# EAGLE design EE445L_Lab_7_Starter (EAGLE 9.6.2)
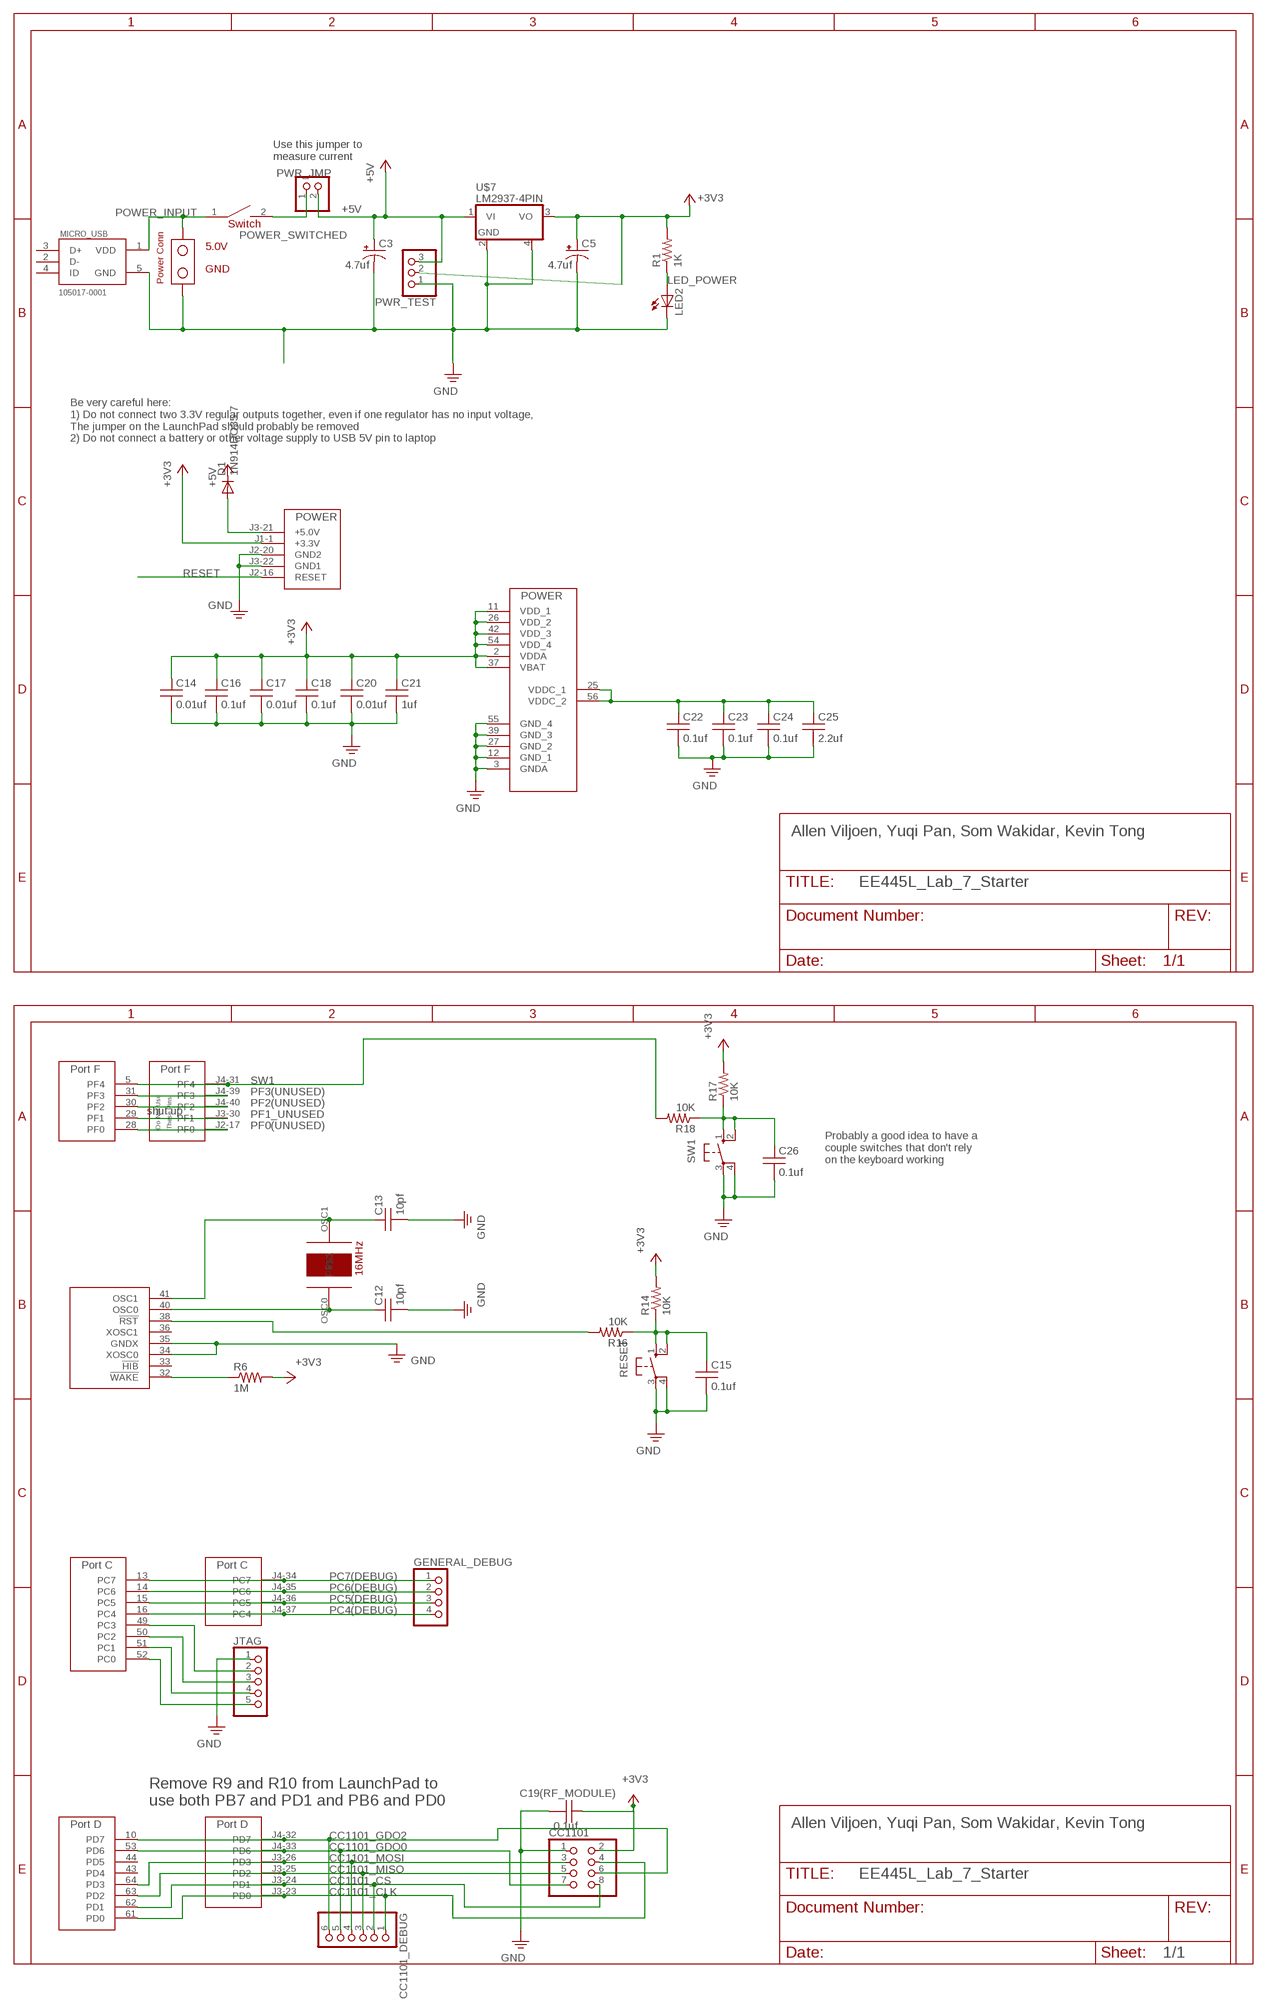
[diagram p0: schematic, sheet 1, part 1 of 2]
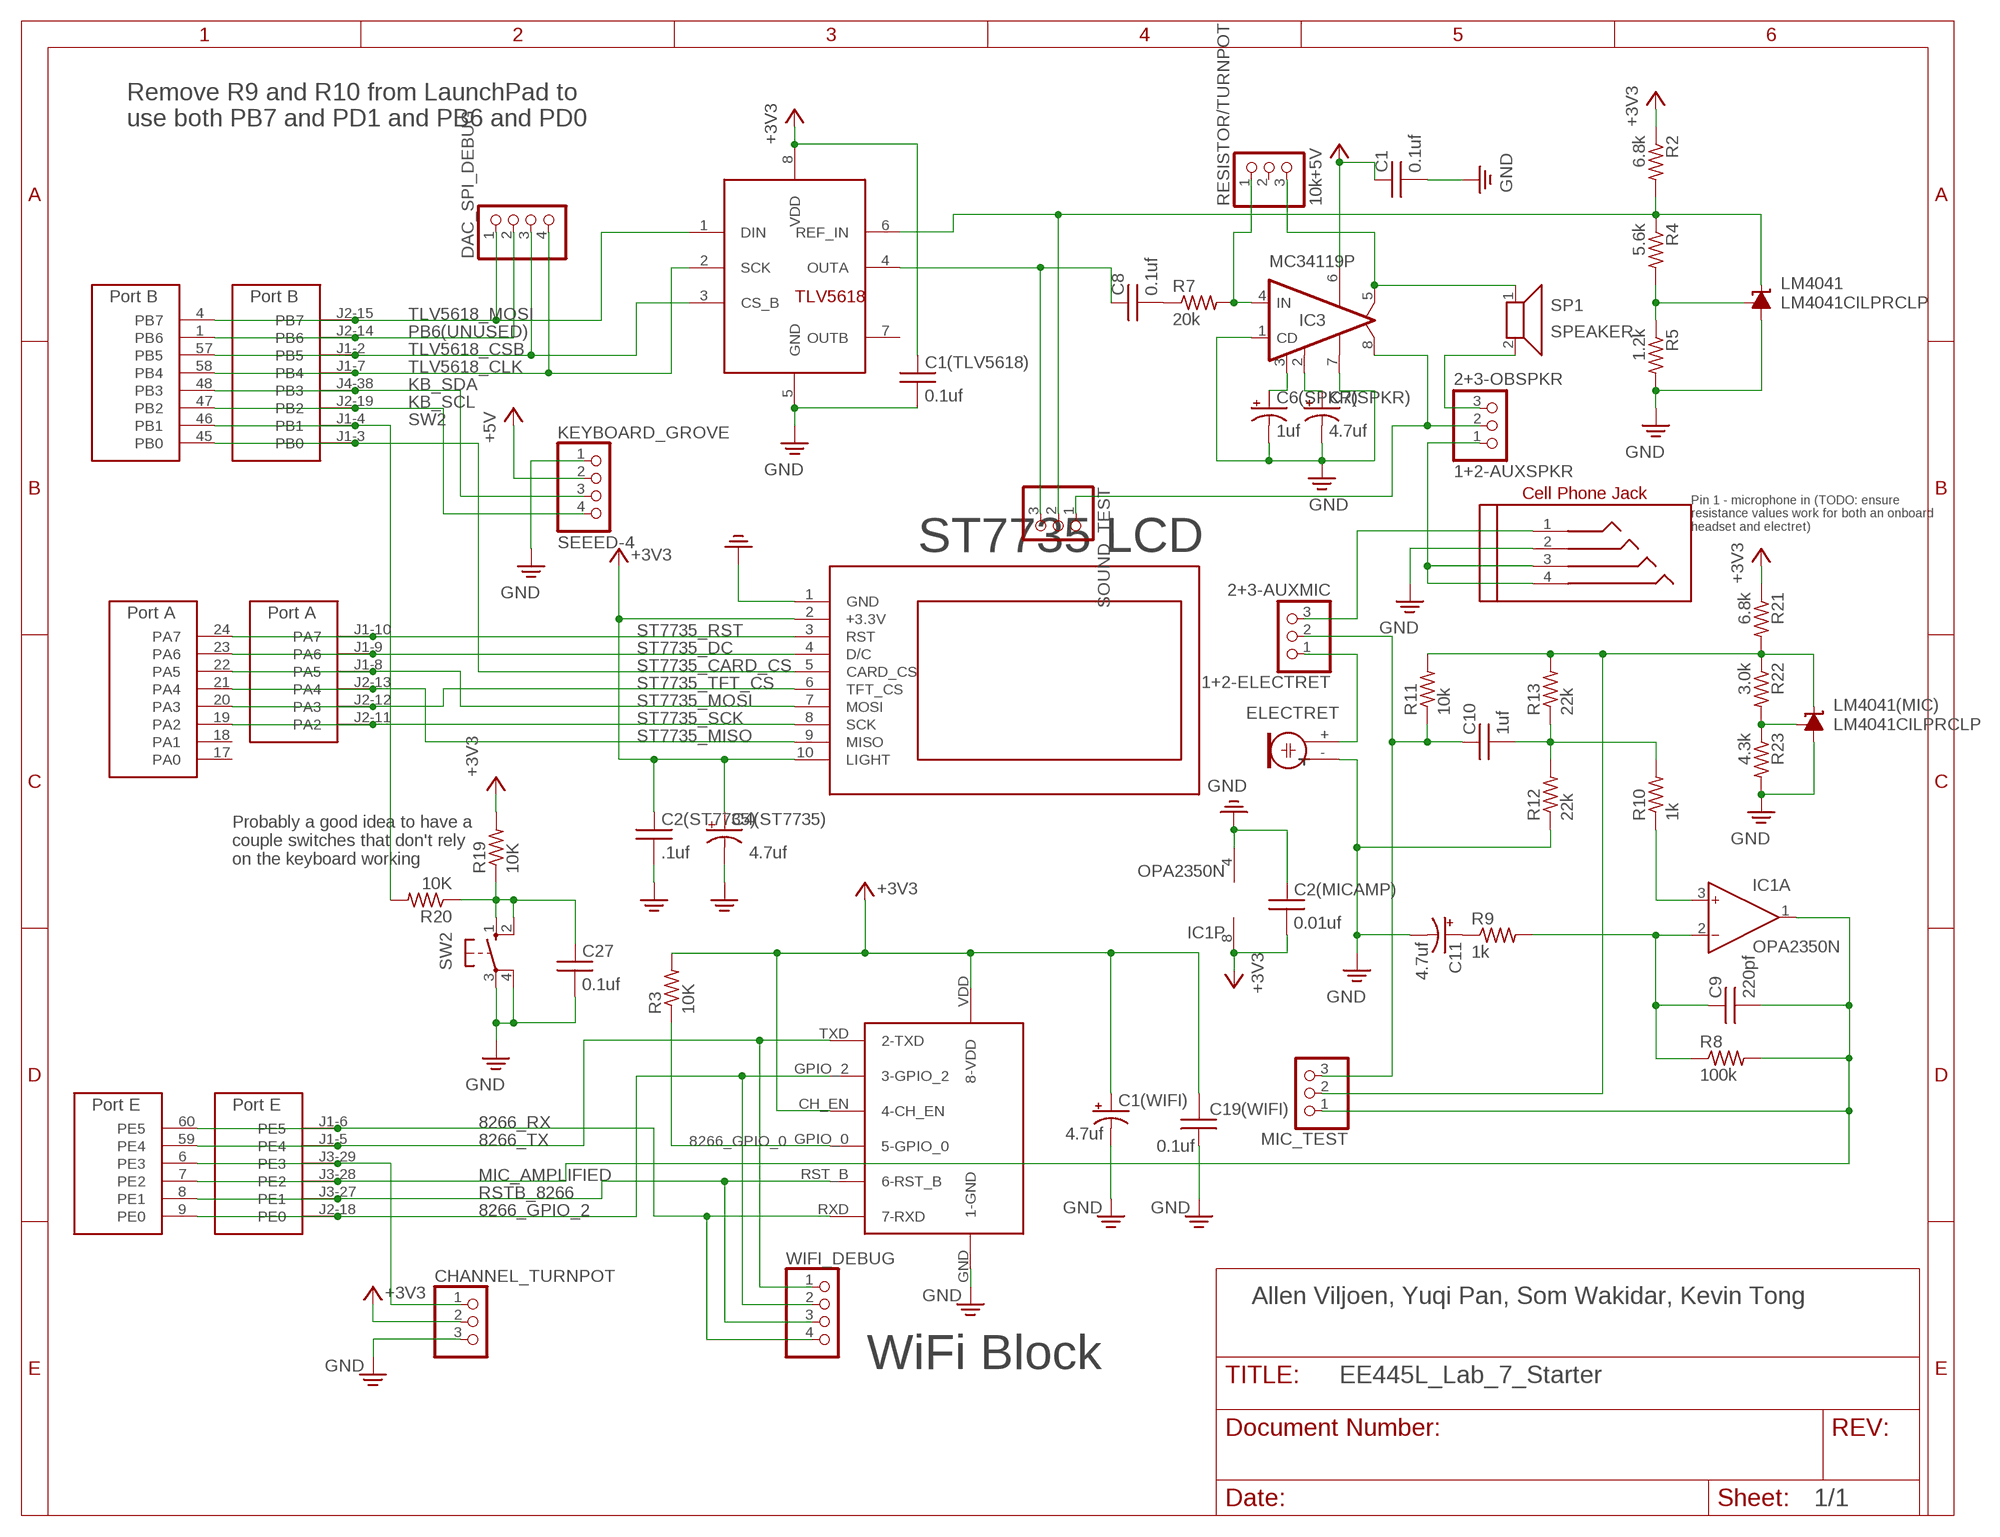
[diagram p1: schematic, sheet 1, part 2 of 2]

## Parts
1+2-AUXSPKR  2+3-OBSPKR  PINHD-1X3  [1X03]
1+2-ELECTRET  2+3-AUXMIC  PINHD-1X3  [1X03]
C1  0.1uf  CAPACITOR025-024X044  [CAP100MIL]
C1(TLV5618)  0.1uf  CAPACITOR050-024X044  [CAP200MIL]
C1(WIFI)  4.7uf  CAPACITOR_POLARIZEDE5-6  [CAP200MILPOLARIZED]
C2(MICAMP)  0.01uf  CAPACITOR050-024X044  [CAP200MIL]
C2(ST7735)  .1uf  CAPACITOR050-024X044  [CAP200MIL]
C3  4.7uf  CAPACITOR_POLARIZEDE5-6  [CAP200MILPOLARIZED]
C4(ST7735)  4.7uf  CAPACITOR_POLARIZEDE5-6  [CAP200MILPOLARIZED]
C5  4.7uf  CAPACITOR_POLARIZEDE5-6  [CAP200MILPOLARIZED]
C6(SPKR)  1uf  CAPACITOR_POLARIZEDE5-6  [CAP200MILPOLARIZED]
C7(SPKR)  4.7uf  CAPACITOR_POLARIZEDE5-6  [CAP200MILPOLARIZED]
C8  0.1uf  CAPACITOR025-024X044  [CAP100MIL]
C9  220pf  CAPACITOR050-024X044  [CAP200MIL]
C10  1uf  CAPACITOR050-024X044  [CAP200MIL]
C11  4.7uf  CAPACITOR_POLARIZEDE5-6  [CAP200MILPOLARIZED]
C12  10pf  CAPACITOR025-024X044  [CAP100MIL]
C13  10pf  CAPACITOR025-024X044  [CAP100MIL]
C14  0.01uf  CAPACITOR025-024X044  [CAP100MIL]
C15  0.1uf  CAPACITOR025-024X044  [CAP100MIL]
C16  0.1uf  CAPACITOR025-024X044  [CAP100MIL]
C17  0.01uf  CAPACITOR025-024X044  [CAP100MIL]
C18  0.1uf  CAPACITOR025-024X044  [CAP100MIL]
C19(RF_MODULE)  0.1uf  CAPACITOR025-024X044  [CAP100MIL]
C19(WIFI)  0.1uf  CAPACITOR050-024X044  [CAP200MIL]
C20  0.01uf  CAPACITOR025-024X044  [CAP100MIL]
C21  1uf  CAPACITOR025-024X044  [CAP100MIL]
C22  0.1uf  CAPACITOR025-024X044  [CAP100MIL]
C23  0.1uf  CAPACITOR025-024X044  [CAP100MIL]
C24  0.1uf  CAPACITOR025-024X044  [CAP100MIL]
C25  2.2uf  CAPACITOR025-024X044  [CAP100MIL]
C26  0.1uf  CAPACITOR025-024X044  [CAP100MIL]
C27  0.1uf  CAPACITOR025-024X044  [CAP100MIL]
CC1101  PINHD-2X4  [2X04]
CC1101_DEBUG  PINHD-1X6  [1X06]
CHANNEL_TURNPOT  PINHD-1X3  [1X03]
D1  1N914DO35-7  [DO35-7]
DAC_SPI_DEBUG  PINHD-1X4/90  [1X04/90]
ELECTRET  ELECTRET  [9.7ELECTRET]
GENERAL_DEBUG  PINHD-1X4/90  [1X04/90]
IC1  OPA2350N  [DIL08]
IC3  MC34119P  [DIL08]
JTAG  PINHD-1X5  [1X05]
KEYBOARD_GROVE  SEEED-4  [1_04X2MM]
LED2  LED3MM  [LED3MM]
LM4041  LM4041CILPRCLP  [LP_O-PBCY-W3]
LM4041(MIC)  LM4041CILPRCLP  [LP_O-PBCY-W3]
MIC_TEST  PINHD-1X3/90  [1X03/90]
MICRO_USB  105017-0001  [MOLEX_105017-0001]
PWR_JMP  PINHD-1X2  [1X02]
PWR_TEST  PINHD-1X3/90  [1X03/90]
R1  1K  RESISTOR0204/5  [RES200MIL]
R2  6.8k  RESISTOR0204/7  [RES300MIL]
R3  10K  RESISTOR0204/7  [RES300MIL]
R4  5.6k  RESISTOR0204/7  [RES300MIL]
R5  1.2k  RESISTOR0204/7  [RES300MIL]
R6  1M  RESISTOR0204/7  [RES300MIL]
R7  20k  RESISTOR0204/7  [RES300MIL]
R8  100k  RESISTOR0204/7  [RES300MIL]
R9  1k  RESISTOR0204/7  [RES300MIL]
R10  1k  RESISTOR0204/7  [RES300MIL]
R11  10k  RESISTOR0204/7  [RES300MIL]
R12  22k  RESISTOR0204/7  [RES300MIL]
R13  22k  RESISTOR0204/7  [RES300MIL]
R14  10K  RESISTOR0204/5  [RES200MIL]
R16  10K  RESISTOR0204/5  [RES200MIL]
R17  10K  RESISTOR0204/5  [RES200MIL]
R18  10K  RESISTOR0204/5  [RES200MIL]
R19  10K  RESISTOR0204/5  [RES200MIL]
R20  10K  RESISTOR0204/5  [RES200MIL]
R21  6.8k  RESISTOR0204/7  [RES300MIL]
R22  3.0k  RESISTOR0204/7  [RES300MIL]
R23  4.3k  RESISTOR0204/7  [RES300MIL]
RESET  B3F-1052  [B3F-10XX]
RESISTOR/TURNPOT  10k  PINHD-1X3/90  [1X03/90]
SOUND_TEST  PINHD-1X3/90  [1X03/90]
SP1  SPEAKER  [1X02]
ST7735  ST7735  [ST7735]
SW1  B3F-1052  [B3F-10XX]
SW2  B3F-1052  [B3F-10XX]
TLV5618  TLV5618  [DIL08]
U$1  ESP_8266  [ESP8266]
U$2  TM4C_BP  [TM4C_BOOSTER_PACK]
U$5  POWER_CONN  [POWER_CONN]
U$6  SW_POWER_100MIL  [SW_POWER]
U$7  LM2937-4PIN  [TO220-4PIN]
U$8  AUDIO_CONN_3.5MM  [AUDIO_CONN_3.5MM]
U$9  TM4C123GH6PM  [QFP50P1200X1200X160-64N]
WIFI_DEBUG  PINHD-1X4/90  [1X04/90]
Y1  16MHZ_CRYSTAL  [16MHZ_CRYSTAL]

## Nets
8266_GPIO_0: R3.1 U$1.GPIO_0(5-GPIO_0)
8266_GPIO_2: U$1.GPIO_2(3-GPIO_2) U$2.J2-18(PE0) U$9.9(PE0) WIFI_DEBUG.2
8266_RX: U$1.RXD(7-RXD) U$2.J1-6(PE5) U$9.60(PE5) WIFI_DEBUG.4
8266_TX: U$1.TXD(2-TXD) U$2.J1-5(PE4) U$9.59(PE4) WIFI_DEBUG.1
+3V3: C1(TLV5618).1 C1(WIFI).+ C2(MICAMP).2 C2(ST7735).1 C4(ST7735).+ C5.+ C14.1 C16.1 C17.1 C18.1 C19(RF_MODULE).1 C19(WIFI).2 C20.1 C21.1 CC1101.2 CHANNEL_TURNPOT.2 IC1.8(P:V+) PWR_TEST.2 R1.2 R2.1 R3.2 R6.2 R14.2 R17.2 R19.2 R21.1 ST7735.2(+3.3V) ST7735.10(LIGHT) TLV5618.8(VDD) U$1.CH_EN(4-CH_EN) U$1.VDD(8-VDD) U$2.J1-1(+3.3V) U$7.3(VO) U$9.2(VDDA) U$9.11(VDD_1) U$9.26(VDD_2) U$9.37(VBAT) U$9.42(VDD_3) U$9.54(VDD_4)
+5V: C1.1 C3.+ D1.C IC3.6(VCC) KEYBOARD_GROVE.2 PWR_JMP.2 PWR_TEST.3 U$7.1(VI)
AUDIO_AMP_OUT: 1+2-AUXSPKR.2 IC3.8(VO2) SOUND_TEST.1
AUX_AUDIO: 1+2-AUXSPKR.1 U$8.3 U$8.4
AUX_MIC: 1+2-ELECTRET.3 U$8.1
CC1101_CLK: CC1101.4 CC1101_DEBUG.1 U$2.J3-23(PD0) U$9.61(PD0)
CC1101_CS: CC1101.8 CC1101_DEBUG.2 U$2.J3-24(PD1) U$9.62(PD1)
CC1101_GDO0: CC1101.7 CC1101_DEBUG.5 U$2.J4-33(PD6) U$9.53(PD6)
CC1101_GDO2: CC1101.6 CC1101_DEBUG.6 U$2.J4-32(PD7) U$9.10(PD7)
CC1101_MISO: CC1101.5 CC1101_DEBUG.3 U$2.J3-25(PD2) U$9.63(PD2)
CC1101_MOSI: CC1101.3 CC1101_DEBUG.4 U$2.J3-26(PD3) U$9.64(PD3)
CHANNEL_TURNPOT: CHANNEL_TURNPOT.1 U$2.J3-29(PE3) U$9.6(PE3)
DAC_OUT: C8.1 SOUND_TEST.3 TLV5618.4(OUTA)
ELECTRET_MIC: 1+2-ELECTRET.1 ELECTRET.+
GND: C1(TLV5618).2 C1(WIFI).- C1.2 C2(MICAMP).1 C2(ST7735).2 C3.- C4(ST7735).- C5.- C6(SPKR).- C7(SPKR).- C11.- C12.2 C13.2 C14.2 C15.2 C16.2 C17.2 C18.2 C19(RF_MODULE).2 C19(WIFI).1 C20.2 C21.2 C22.2 C23.2 C24.2 C25.2 C26.2 C27.2 CC1101.1 CHANNEL_TURNPOT.3 ELECTRET.- IC1.4(P:V-) IC3.1(CD) IC3.7(GND) JTAG.1 KEYBOARD_GROVE.1 LED2.K(C) LM4041(MIC).3(A) LM4041.3(A) MICRO_USB.5(GND) PWR_TEST.1 R5.2 R12.1 R23.2 RESET.3(P) RESET.4(P1) ST7735.1(GND) SW1.3(P) SW1.4(P1) SW2.3(P) SW2.4(P1) TLV5618.5(GND) U$1.GND(1-GND) U$2.J2-20(GND2) U$2.J3-22(GND1) U$5.GND U$7.2(GND) U$7.4(PAD) U$8.2 U$9.3(GNDA) U$9.12(GND_1) U$9.27(GND_2) U$9.34(XOSC0) U$9.35(GNDX) U$9.39(GND_3) U$9.55(GND_4)
ICDI-TCK/SWCLK: JTAG.5 U$9.52(PC0)
ICDI-TDI: JTAG.3 U$9.50(PC2)
ICDI-TDO/SWO: JTAG.2 U$9.49(PC3)
ICDI-TMS/SWDIO: JTAG.4 U$9.51(PC1)
KB_SCL: KEYBOARD_GROVE.4 U$2.J2-19(PB2) U$9.47(PB2)
KB_SDA: KEYBOARD_GROVE.3 U$2.J4-38(PB3) U$9.48(PB3)
LED_POWER: LED2.A R1.1
MIC_AMPLIFIED: C9.2 IC1.1(A:OUT) MIC_TEST.1 R8.2 U$2.J3-28(PE2) U$9.7(PE2)
MIC_FEEDBACK/GND: C9.1 IC1.2(A:IN-) R8.1 R9.2
MIC_FILTER: C10.2 R10.2 R12.2 R13.1
MIC_FILTERED: IC1.3(A:IN+) R10.1
MIC_OUT_RAW: 1+2-ELECTRET.2 C10.1 MIC_TEST.3 R11.1
MIC_REF: LM4041(MIC).2(C) MIC_TEST.2 R11.2 R13.2 R21.2 R22.1
MIC_REF_FB: LM4041(MIC).1(FB) R22.2 R23.1
N$1: C8.2 R7.1
N$2: C11.+ R9.1
N$3: D1.A U$2.J3-21(+5.0V)
OSC0: C12.1 U$9.40(OSC0) Y1.OSC0
OSC1: C13.1 U$9.41(OSC1) Y1.OSC1
PB6(UNUSED): DAC_SPI_DEBUG.2 U$2.J2-14(PB6) U$9.1(PB6)
PC4(DEBUG): GENERAL_DEBUG.4 U$2.J4-37(PC4) U$9.16(PC4)
PC5(DEBUG): GENERAL_DEBUG.3 U$2.J4-36(PC5) U$9.15(PC5)
PC6(DEBUG): GENERAL_DEBUG.2 U$2.J4-35(PC6) U$9.14(PC6)
PC7(DEBUG): GENERAL_DEBUG.1 U$2.J4-34(PC7) U$9.13(PC7)
PF0(UNUSED): U$2.J2-17(PF0) U$9.28(PF0)
PF1_UNUSED: U$2.J3-30(PF1) U$9.29(PF1)
PF2(UNUSED): U$2.J4-40(PF2) U$9.30(PF2)
PF3(UNUSED): U$2.J4-39(PF3) U$9.31(PF3)
POWER_INPUT: MICRO_USB.1(VDD) U$5.VDD U$6.1
POWER_SWITCHED: PWR_JMP.1 U$6.2
RESET: U$2.J2-16(RESET)
RESET_DEBOUNCE: C15.1 R14.1 R16.1 RESET.1(S) RESET.2(S1)
RESET_IN: R16.2 U$9.38(!RST)
RSTB_8266: U$1.RST_B(6-RST_B) U$2.J3-27(PE1) U$9.8(PE1) WIFI_DEBUG.3
SPKR_OUT: 1+2-AUXSPKR.3 SP1.2
SPKRAMP_GND0: C7(SPKR).+ IC3.2(FC2)
SPKRAMP_GND1: C6(SPKR).+ IC3.3(FC1)
SPKRAMP_OUT: IC3.5(VO1) RESISTOR/TURNPOT.3 SP1.1
SPKRAMP_TURNPOT: IC3.4(IN) R7.2 RESISTOR/TURNPOT.1
ST7735_CARD_CS: ST7735.5(CARD_CS) U$2.J1-3(PB0) U$9.45(PB0)
ST7735_DC: ST7735.4(D/C) U$2.J1-9(PA6) U$9.23(PA6)
ST7735_MISO: ST7735.9(MISO) U$2.J2-13(PA4) U$9.21(PA4)
ST7735_MOSI: ST7735.7(MOSI) U$2.J1-8(PA5) U$9.22(PA5)
ST7735_RST: ST7735.3(RST) U$2.J1-10(PA7) U$9.24(PA7)
ST7735_SCK: ST7735.8(SCK) U$2.J2-11(PA2) U$9.19(PA2)
ST7735_TFT_CS: ST7735.6(TFT_CS) U$2.J2-12(PA3) U$9.20(PA3)
SW1: R18.2 U$2.J4-31(PF4) U$9.5(PF4)
SW1_DEBOUNCE: C26.1 R17.1 R18.1 SW1.1(S) SW1.2(S1)
SW2: R20.2 U$2.J1-4(PB1) U$9.46(PB1)
SW2_DEBOUNCE: C27.1 R19.1 R20.1 SW2.1(S) SW2.2(S1)
TLV5616_REF_FB: LM4041.1(FB) R4.2 R5.1
TLV5618_CLK: DAC_SPI_DEBUG.4 TLV5618.2(SCK) U$2.J1-7(PB4) U$9.58(PB4)
TLV5618_CSB: DAC_SPI_DEBUG.3 TLV5618.3(CS_B) U$2.J1-2(PB5) U$9.57(PB5)
TLV5618_MOSI: DAC_SPI_DEBUG.1 TLV5618.1(DIN) U$2.J2-15(PB7) U$9.4(PB7)
TLV5618_REF: LM4041.2(C) R2.2 R4.1 SOUND_TEST.2 TLV5618.6(REF_IN)
VDDC: C22.1 C23.1 C24.1 C25.1 U$9.25(VDDC_1) U$9.56(VDDC_2)
WAKE: R6.1 U$9.32(!WAKE)
Unconnected: IC1.5(B:IN+) IC1.6(B:IN-) IC1.7(B:OUT) MICRO_USB.2(D-) MICRO_USB.3(D+) MICRO_USB.4(ID) RESISTOR/TURNPOT.2 TLV5618.7(OUTB) U$9.17(PA0) U$9.18(PA1) U$9.33(!HIB) U$9.36(XOSC1) U$9.43(PD4) U$9.44(PD5)

## Notes on the sheet
- Use this jumper to
  measure current
- Be very careful here:
  1) Do not connect two 3.3V regular outputs together, even if one regulator has no input voltage,
  The jumper on the LaunchPad should probably be removed
  2) Do not connect a battery or other voltage supply to USB 5V pin to laptop
- Allen Viljoen, Yuqi Pan, Som Wakidar, Kevin Tong
- Remove R9 and R10 from LaunchPad to
  use both PB7 and PD1 and PB6 and PD0
- shut up
- Probably a good idea to have a 
  couple switches that don't rely 
  on the keyboard working
- Pin 1 - microphone in (TODO: ensure
  resistance values work for both an onboard
  headset and electret)
- ST7735 LCD
- Probably a good idea to have a 
  couple switches that don't rely 
  on the keyboard working
- Remove R9 and R10 from LaunchPad to
  use both PB7 and PD1 and PB6 and PD0
- Allen Viljoen, Yuqi Pan, Som Wakidar, Kevin Tong
- Allen Viljoen, Yuqi Pan, Som Wakidar, Kevin Tong
- WiFi Block

## Library data of the parts
1+2-AUXSPKR 1+2-ELECTRET CHANNEL_TURNPOT MIC_TEST PWR_TEST RESISTOR/TURNPOT SOUND_TEST = EE445L:PINHD-1X3: PIN HEADER
C1 C1(TLV5618) C2(MICAMP) C2(ST7735) C8-C10 C12-C18 C19(RF_MODULE) C19(WIFI) C20-C27 = EE445L:CAPACITOR: CAPACITOR, American symbol
C1(WIFI) C3 C4(ST7735) C5 C6(SPKR) C7(SPKR) C11 = EE445L:CAPACITOR_POLARIZED: POLARIZED CAPACITOR, American symbol
CC1101 = EE445L:PINHD-2X4: PIN HEADER
CC1101_DEBUG = EE445L:PINHD-1X6: PIN HEADER
D1 = EE445L:1N914: DIODE high speed (Philips) 1N914
DAC_SPI_DEBUG GENERAL_DEBUG WIFI_DEBUG = EE445L:PINHD-1X4: PIN HEADER
ELECTRET = EE445L:ELECTRET: Electret microphone Thru hole 2.54mm spacing with 9.7mm diameter
IC1 = EE445L:OPA2350: 2.7V to 5.5V Rail-to-Rail I/O Dual Amplifier High-Speed 38MHz, Single-Supply, slew rate 22V/us, 500uV offset, 4uV noise; OC_FARNELL: unknown; OC_NEWARK: unknown
IC3 = EE445L:MC34119: Low Power Audio Amplifier Motorola
JTAG = EE445L:PINHD-1X5: PIN HEADER
KEYBOARD_GROVE = EE445L:SEEED-4: Seeedstudio grove 2mm spacing, Valvano http://www.seeedstudio.com/depot/Grove-Universal-4-pin-connector-9010-PCs-p-790.html?cPath=44_80
LED2 = EE445L:LED: Avago Technologies LED Green 2mA 5mm diffused, HLMP-4740, Digikey 516-1327-ND Red 1.6V 1mA 5mm diffused, HLMP-D150, Digikey 516-1323-ND Yellow 2mA 5mm diffused, HLMP-4719, Digikey 516-1326-ND Orange 10mA 5mm diffused HLMP-D401, Digikey 516-1330-ND Blue 10mA 5mm diffused
LM4041 LM4041(MIC) = EE445L:LM4041CILPR: PRECISION MICROPOWER SHUNT VOLTAGE REFERENCE Adjustable Output Source: http://focus.ti.com/lit/ds/slcs146e/slcs146e.pdf LM4041CILPR Let R1 be the resistor from Vref to +3.3V Let R2 be the resistor from Vref to FB Let R3 be the resistor from FB to ground Vref = 1.23*(1+R3/R2) Iref=(3.3V-Vref)/R1 - 100uA; MPN: LM4041CILP; OC_FARNELL: 1673945; OC_NEWARK: 50M8856
MICRO_USB = 105017-0001:105017-0001: Check availability <https://pricing.snapeda.com/parts/105017-0001/Molex/view-part?ref=eda>; AVAILABILITY: In Stock; DESCRIPTION: USB - micro B USB 2.0 Receptacle Connector 5 Position Surface Mount, Right Angle; Through Hole; MF: Molex; MP: 105017-0001; PACKAGE: None; PRICE: None; PURCHASE-URL: https://pricing.snapeda.com/search/part/105017-0001/?ref=eda
PWR_JMP = EE445L:PINHD-1X2: PIN HEADER
R1-R14 R16-R23 = EE445L:RESISTOR: RESISTOR, American symbol
RESET SW1 SW2 = EE445L:B3F-1052: OMRON SWITCH 1.1mm holes; MPN: B3F-1000; OC_FARNELL: 176432; OC_NEWARK: 36M3542
SP1 = EE445L:SPEAKER: Speaker Connected off PCB with two wires. 32-ohm speaker, AllElectronics, SK-230, http://www.allelectronics.com/make-a-store/item/sk-230/20-mm-32-ohm-speaker/1.html
ST7735 = EE445L:ST7735
TLV5618 = EE445L:TLV5618: The TLV5618A is a dual 12-bit voltage output DAC with a flexible 3-wire serial interface. The serial interface is compatible with TMS320, SPI, QSPI, and Microwire serial ports. It is programmed with a 16-bit serial string containing 4 control and 12 data bits
U$1 = EE445L:ESP_8266
U$2 = EE445L:TM4C_BP
U$5 = EE445L:POWER_CONN
U$6 = EE445L:SW_POWER_100MIL
U$7 = EE445L:LM2937-4PIN
U$8 = EE445L:AUDIO_CONN_3.5MM
U$9 = EE445L:TM4C123GH6PM
Y1 = EE445L:16MHZ_CRYSTAL

## Board
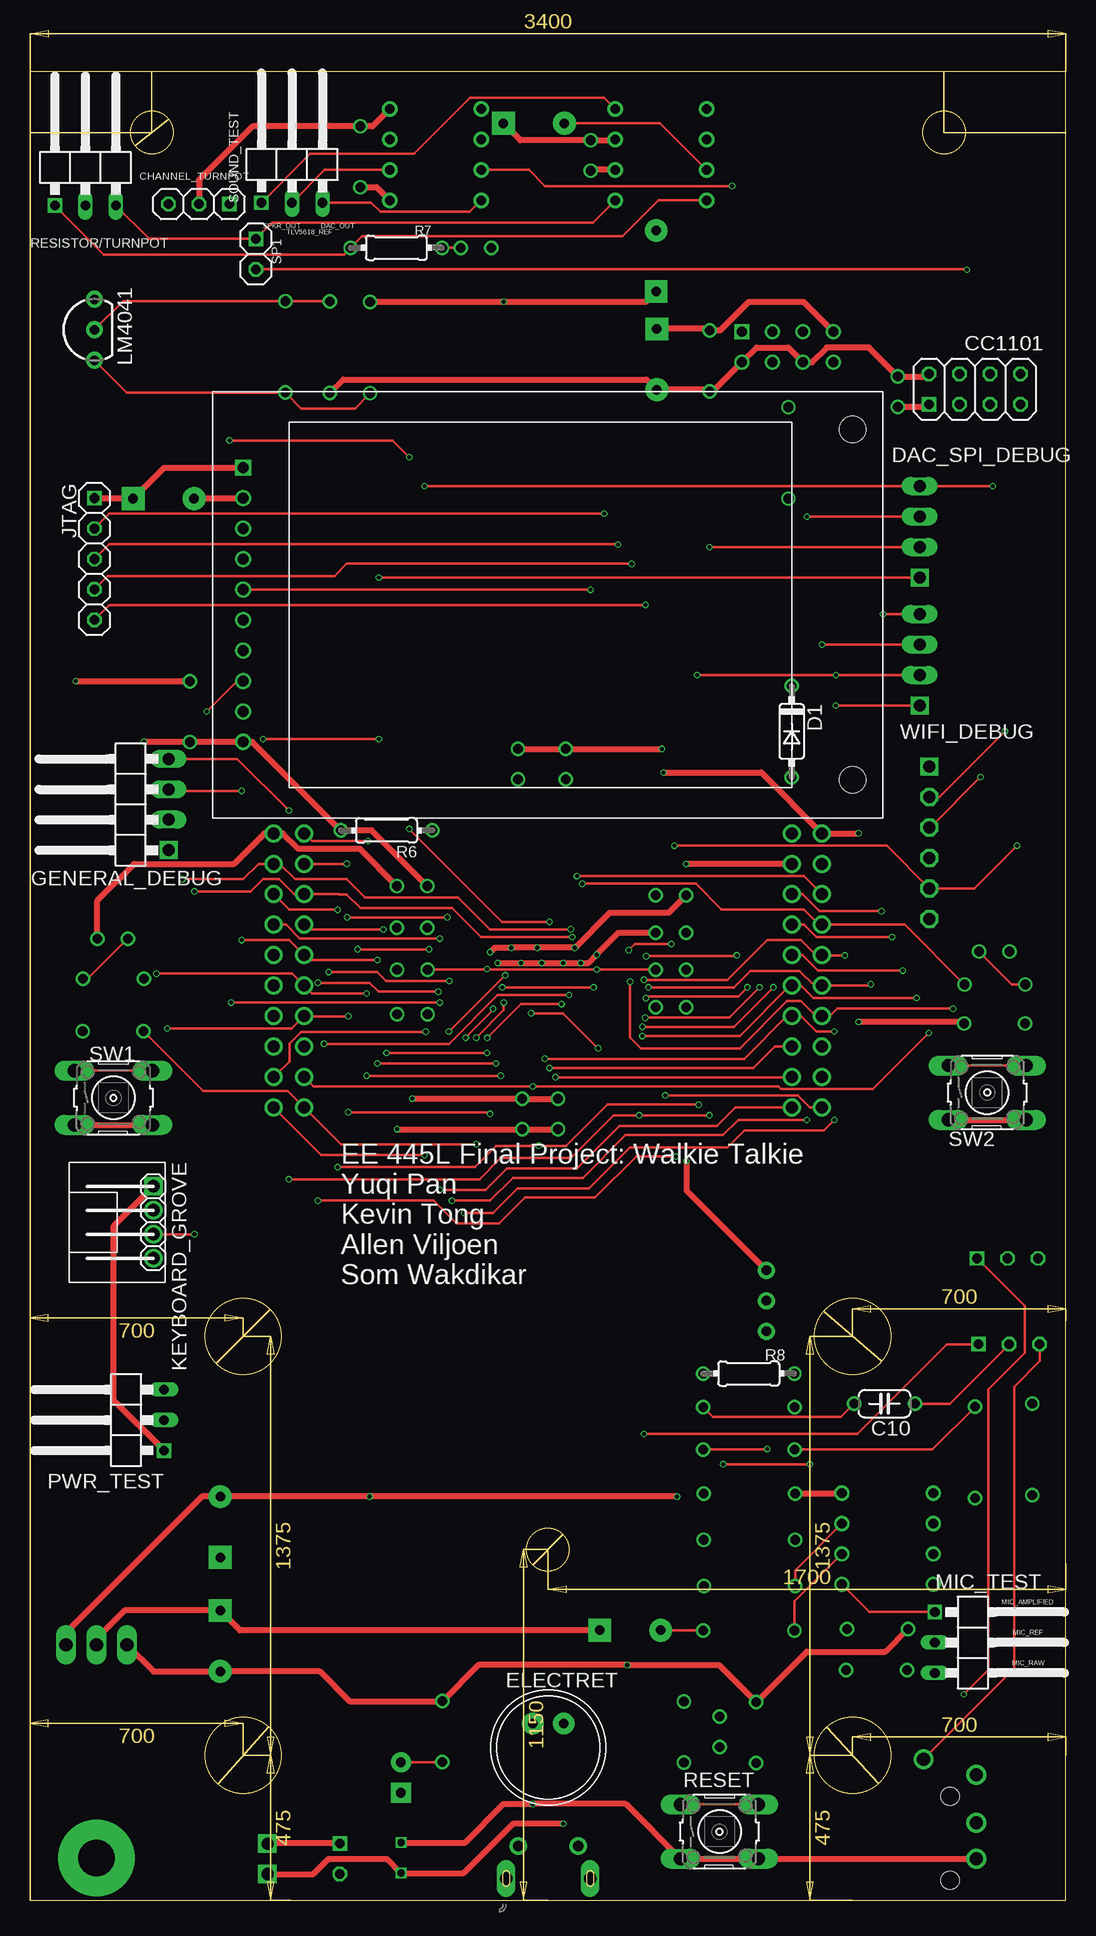
[diagram p2: board, top side]
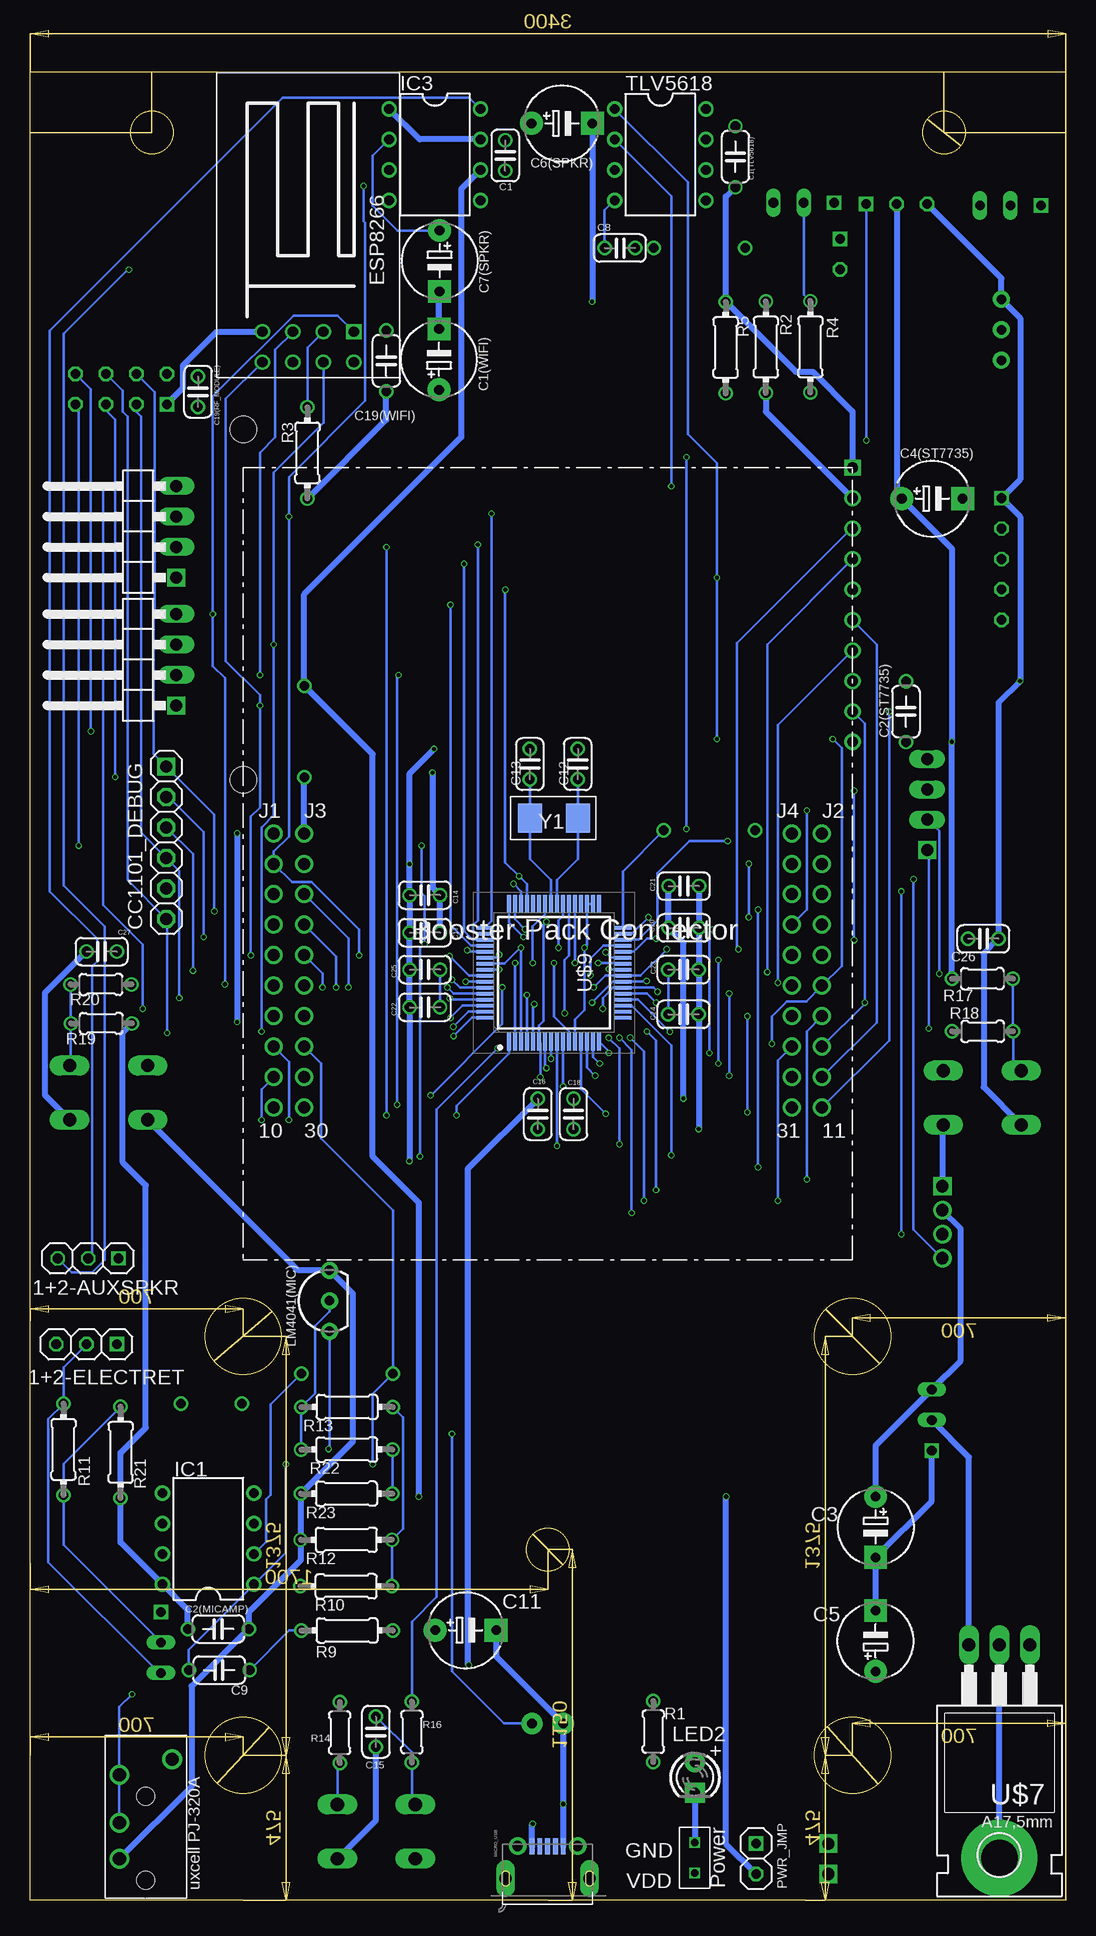
[diagram p3: board, bottom side, seen from below]

Size 86.36 x 152.4 mm. Coordinates in mm from the lower left corner, seen from the top.
Outline: 0,0 86.36,0 86.36,152.4 0,152.4 0,0
Outline: circle at 10.16,147.32 radius 1.78
Outline: circle at 76.2,147.32 radius 1.78
Outline: circle at 17.78,46.99 radius 3.17
Outline: circle at 68.58,46.99 radius 3.17
Outline: circle at 68.58,12.06 radius 3.17
Outline: circle at 17.78,12.06 radius 3.17
Outline: circle at 43.18,29.21 radius 1.78
Copper layers (1*16): Top 0.035559375mm / dielectric 1.6mm / Bottom 0.035559375mm
Design rules "jlcpcb2layer": minimum track width 5mil, minimum drill 12mil, track to track 5mil, track to pad 5mil, pad to pad 5mil, via to via 5mil, smd to smd 5mil, copper to edge 8mil, drill to drill 6mil, minimum pad ring 5mil, minimum via ring 3mil, stop-mask expansion 2.5mil, vias tented up to drill 0mil, thermal gap 10mil

### Footprints (pad centres in the part's own frame; a part is rotated, then mirrored left to right if it is on the bottom)
1X03 = drill 0.8 square: 1 -2.54,0 | drill 0.8 octagon: 2 0,0; 3 2.54,0
CAP100MIL = drill 0.8: 1 -1.27,0; 2 1.27,0
CAP200MIL = drill 0.8: 1 -2.54,0; 2 2.54,0
CAP200MILPOLARIZED = drill 0.8 pad 1.905: + -2.54,0 | drill 0.8 pad 1.905 square: - 2.54,0
2X04 = drill 0.8 square: 1 -3.81,-1.27 | drill 0.8 octagon: 2 -3.81,1.27; 3 -1.27,-1.27; 4 -1.27,1.27; 5 1.27,-1.27; 6 1.27,1.27; 7 3.81,-1.27; 8 3.81,1.27
1X06 = drill 1 square: 1 -6.35,0 | drill 1 octagon: 2 -3.81,0; 3 -1.27,0; 4 1.27,0; 5 3.81,0; 6 6.35,0
DO35-7 = drill 0.8: A 3.81,0; C -3.81,0
1X04/90 = drill 1 square: 1 -3.81,-3.81 | drill 1 long: 2 -1.27,-3.81; 3 1.27,-3.81; 4 3.81,-3.81
9.7ELECTRET = drill 0.8 pad 1.778: + 1.3,2; - -1.3,2
DIL08 = drill 0.813 pad 1.27: 1 -3.81,-3.81; 2 -1.27,-3.81; 3 1.27,-3.81; 4 3.81,-3.81; 5 3.81,3.81; 6 1.27,3.81; 7 -1.27,3.81; 8 -3.81,3.81
1X05 = drill 0.8 square: 1 -5.08,0 | drill 0.8 octagon: 2 -2.54,0; 3 0,0; 4 2.54,0; 5 5.08,0
1_04X2MM = drill 1.016 pad 1.3 square: 1 -4,0 | drill 1.016 pad 1.3: 2 -2,0; 3 0,0; 4 2,0
LED3MM = drill 0.8 pad 1.676: A -1.27,0 | drill 0.8 pad 1.676 square: K 1.27,0
LP_O-PBCY-W3 = drill 0.8 pad 1.4: 1 -2.54,0; 2 0,0; 3 2.54,0
1X03/90 = drill 0.8 square: 1 -2.54,-3.81 | drill 0.8 long: 2 0,-3.81; 3 2.54,-3.81
MOLEX_105017-0001 = smd 0.4 x 1.35: 1 -1.3,2.675; 2 -0.65,2.675; 3 0,2.675; 4 0.65,2.675; 5 1.3,2.675 | drill 0.85 pad 1.45: P$1 -2.5,2.7; P$2 2.5,2.7 | drill 1.016 pad 1.27 long: P$12 -3.5,0; P$13 3.5,0
1X02 = drill 0.8 square: 1 -1.27,0 | drill 0.8 octagon: 2 1.27,0
RES200MIL = drill 0.8: 1 -2.54,0; 2 2.54,0
RES300MIL = drill 0.8: 1 -3.81,0; 2 3.81,0
B3F-10XX = drill 1.1 long: 1 -3.251,2.261; 2 3.251,2.261; 3 -3.251,-2.261; 4 3.251,-2.261
ST7735 = drill 0.9 square: 1 0,0 | drill 0.9: 2 0,-2.54; 3 0,-5.08; 4 0,-7.62; 5 0,-10.16; 6 0,-12.7; 7 0,-15.24; 8 0,-17.78; 9 0,-20.32; 10 0,-22.86 | hole 2.184: 50.8,3.175; 50.8,-26.035
ESP8266 = drill 0.85: CH_EN 1.27,-1.27; GND -1.27,-3.81; GPIO_0 -1.27,1.27; GPIO_2 -1.27,-1.27; RST_B 1.27,1.27; TXD 1.27,-3.81; VDD 1.27,3.81 | drill 0.85 square: RXD -1.27,3.81
TM4C_BOOSTER_PACK = drill 1: J1-1 0,22.86; J1-2 0,20.32; J1-3 0,17.78; J1-4 0,15.24; J1-5 0,12.7; J1-6 0,10.16; J1-7 0,7.62; J1-8 0,5.08; J1-9 0,2.54; J1-10 0,0; J2-11 45.72,0; J2-12 45.72,2.54; J2-13 45.72,5.08; J2-14 45.72,7.62; J2-15 45.72,10.16; J2-16 45.72,12.7; J2-17 45.72,15.24; J2-18 45.72,17.78; J2-19 45.72,20.32; J2-20 45.72,22.86; J3-21 2.54,22.86; J3-22 2.54,20.32; J3-23 2.54,17.78; J3-24 2.54,15.24; J3-25 2.54,12.7; J3-26 2.54,10.16; J3-27 2.54,7.62; J3-28 2.54,5.08; J3-29 2.54,2.54; J3-30 2.54,0; J4-31 43.18,0; J4-32 43.18,2.54; J4-33 43.18,5.08; J4-34 43.18,7.62; J4-35 43.18,10.16; J4-36 43.18,12.7; J4-37 43.18,15.24; J4-38 43.18,17.78; J4-39 43.18,20.32; J4-40 43.18,22.86
POWER_CONN = drill 0.6 square: GND 2.54,0; VDD 0,0
SW_POWER = drill 1.016 square: 1 -1.27,0; 2 1.27,0
TO220-4PIN = drill 1.1 long: 1 -2.54,-6.35; 2 0,-6.35; 3 2.54,-6.35 | drill 3.048 pad 6.35: 4 0,11.43
AUDIO_CONN_3.5MM = drill 1.1: 1 11.6,-2.2; 2 3.3,2.2; 3 6.3,2.2; 4 10.3,2.2 | hole 1.5: 1.5,0; 8.5,0
QFP50P1200X1200X160-64N = smd 1.475 x 0.3: 1 -5.738,3.75; 2 -5.738,3.25; 3 -5.738,2.75; 4 -5.738,2.25; 5 -5.738,1.75; 6 -5.738,1.25; 7 -5.738,0.75; 8 -5.738,0.25; 9 -5.738,-0.25; 10 -5.738,-0.75; 11 -5.738,-1.25; 12 -5.738,-1.75; 13 -5.738,-2.25; 14 -5.738,-2.75; 15 -5.738,-3.25; 16 -5.738,-3.75; 33 5.738,-3.75; 34 5.738,-3.25; 35 5.738,-2.75; 36 5.738,-2.25; 37 5.738,-1.75; 38 5.738,-1.25; 39 5.738,-0.75; 40 5.738,-0.25; 41 5.738,0.25; 42 5.738,0.75; 43 5.738,1.25; 44 5.738,1.75; 45 5.738,2.25; 46 5.738,2.75; 47 5.738,3.25; 48 5.738,3.75 | smd 0.3 x 1.475: 17 -3.75,-5.738; 18 -3.25,-5.738; 19 -2.75,-5.738; 20 -2.25,-5.738; 21 -1.75,-5.738; 22 -1.25,-5.738; 23 -0.75,-5.738; 24 -0.25,-5.738; 25 0.25,-5.738; 26 0.75,-5.738; 27 1.25,-5.738; 28 1.75,-5.738; 29 2.25,-5.738; 30 2.75,-5.738; 31 3.25,-5.738; 32 3.75,-5.738; 49 3.75,5.738; 50 3.25,5.738; 51 2.75,5.738; 52 2.25,5.738; 53 1.75,5.738; 54 1.25,5.738; 55 0.75,5.738; 56 0.25,5.738; 57 -0.25,5.738; 58 -0.75,5.738; 59 -1.25,5.738; 60 -1.75,5.738; 61 -2.25,5.738; 62 -2.75,5.738; 63 -3.25,5.738; 64 -3.75,5.738
16MHZ_CRYSTAL = smd 2 x 2.4: OSC0 1,1.27; OSC1 5,1.27

### Placement (x,y rotation side)
1+2-AUXSPKR  81.51,53.48 180 bottom
1+2-ELECTRET  81.64,46.32 180 bottom
C1  46.74,145.41 90 bottom
C1(TLV5618)  27.55,145.31 270 bottom
C1(WIFI)  52.26,128.42 90 bottom
C2(MICAMP)  70.66,22.59 180 bottom
C2(ST7735)  13.34,99.06 90 bottom
C3  15.86,31.09 270 bottom
C4(ST7735)  11.14,116.81 0 bottom
C5  15.86,21.59 90 bottom
C6(SPKR)  42.01,148.1 0 bottom
C7(SPKR)  52.21,136.63 270 bottom
C8  37.17,137.69 0 bottom
C9  70.59,19.16 180 bottom
C10  71.25,41.37 180 top
C11  50.04,22.49 0 bottom
C12  40.69,94.68 90 bottom
C13  44.68,94.68 90 bottom
C14  53.44,83.75 180 bottom
C15  57.52,14.02 270 bottom
C16  44.02,65.52 270 bottom
C17  53.44,80.63 180 bottom
C18  41.05,65.52 270 bottom
C19(RF_MODULE)  72.35,125.73 270 bottom
C19(WIFI)  56.65,128.3 270 bottom
C20  31.85,81.04 0 bottom
C21  31.85,84.52 0 bottom
C22  53.44,74.41 180 bottom
C23  31.88,77.56 0 bottom
C24  31.88,73.82 0 bottom
C25  53.44,77.56 180 bottom
C26  6.88,80.13 0 bottom
C27  80.39,79.06 180 bottom
CC1101  78.77,125.95 0 top
CC1101_DEBUG  74.99,88.14 270 bottom
CHANNEL_TURNPOT  14.1,141.36 180 top
D1  63.5,97.41 270 top
DAC_SPI_DEBUG  77.98,114.05 90 bottom
ELECTRET  43.21,12.71 0 top
GENERAL_DEBUG  7.75,91.31 90 top
IC1  71.5,30.11 90 bottom
IC3  52.6,145.48 270 bottom
JTAG  5.36,111.77 270 top
KEYBOARD_GROVE  10.29,55.5 270 top
LED2  30.93,10.21 270 bottom
LM4041  5.37,130.89 90 top
LM4041(MIC)  61.39,49.95 90 bottom
MIC_TEST  79.25,21.46 270 top
MICRO_USB  43.21,1.79 0 bottom
PWR_JMP  25.83,3.44 270 bottom
PWR_TEST  7.37,40.01 90 top
R1  34.39,14.04 90 bottom
R2  25.01,129.44 90 bottom
R3  63.23,120.62 270 bottom
R4  21.3,129.46 270 bottom
R5  28.36,129.41 90 bottom
R6  29.72,89.15 180 top
R7  30.54,137.72 180 top
R8  59.92,43.88 180 top
R9  59.92,22.47 180 bottom
R10  59.99,26.15 0 bottom
R11  83.57,37.56 270 bottom
R12  59.98,30.02 0 bottom
R13  59.93,41.1 180 bottom
R14  60.54,13.94 90 bottom
R16  54.52,14 90 bottom
R17  6.96,76.8 180 bottom
R18  6.93,72.4 180 bottom
R19  80.42,73.06 0 bottom
R20  80.44,76.32 0 bottom
R21  78.8,37.31 90 bottom
R22  59.94,37.55 0 bottom
R23  59.97,33.87 180 bottom
RESET  57.48,5.7 0 top
RESISTOR/TURNPOT  4.62,145.05 0 top
SOUND_TEST  21.84,145.29 0 top
SP1  18.82,137.2 270 top
ST7735  17.78,119.39 0 top
SW1  6.96,66.87 0 top
SW2  79.81,67.3 0 top
TLV5618  33.81,145.48 270 bottom
U$1  63.17,129.45 270 bottom
U$2  66.04,66.05 0 bottom
U$5  30.94,2.25 90 bottom
U$6  19.8,3.43 90 top
U$7  5.54,14.92 180 bottom
U$8  76.71,0.14 90 bottom
U$9  42.67,77.3 90 bottom
WIFI_DEBUG  77.98,103.38 90 bottom
Y1  39.67,91.45 180 bottom

### Tracks (layer width: path | path; a pad name or v marks a point on that pad's centre or on a via)
8266_GPIO_0
  Bottom 0.203: U$1.GPIO_0 63.23,129.39 R3.1
8266_GPIO_2  (via drill 0.35)
  Top 0.203: v25.65,61.09 37.08,61.09 38.86,62.87 v42.42,62.87 44.7,62.87 48.13,66.29 v55.75,66.29 | v25.65,82.55 21.6,82.55 U$2.J2-18 | v55.63,102.11 v67.18,102.11 WIFI_DEBUG.2
  Bottom 0.203: U$9.9 v42.42,62.87 | v25.65,82.55 v25.65,61.09 | U$1.GPIO_2 64.44,130.69 65.91,129.22 65.91,121.92 67.18,120.65 v67.18,102.11 | v55.63,102.11 55.75,101.98 v55.75,66.29
8266_RX  (via drill 0.35)
  Top 0.203: v51.56,76.07 58.67,76.07 60.05,77.45 64.17,77.45 65.41,76.21 U$2.J1-6 69.99,76.21 v70.1,76.33 | v71.12,107.19 WIFI_DEBUG.4
  Bottom 0.203: U$9.60 51.04,75.55 v51.56,76.07 | v70.1,76.33 70.1,101.85 71.12,102.87 v71.12,107.19 71.12,125.35 64.39,132.08 60.72,132.08 U$1.RXD
8266_TX  (via drill 0.35)
  Top 0.203: v51.18,76.71 58.17,76.71 61.47,80.01 64.28,80.01 65.53,78.75 U$2.J1-5 66.05,78.74 v67.94,78.74 | v67.18,99.57 WIFI_DEBUG.1
  Bottom 0.203: U$9.59 50.53,76.05 v51.18,76.71 | U$1.TXD 70.03,125.14 70.03,103.29 67.18,100.45 v67.18,99.57 67.18,91.06 67.94,90.3 v67.94,78.74
+3V3  (via drill 0.35)
  Top 0.508: U$7.3 10.3,19.05 C5.+ 24.17,19.05 26.64,16.57 R1.2 37.4,19.58 v49.78,19.58 57.44,19.58 R14.2 64.76,20.7 71.31,20.7 C2(MICAMP).2 | C21.1 28.48,89.15 R6.2 18.53,96.53 ST7735.10 17.77,96.52 C2(ST7735).1 9.51,96.52 v9.5,96.53 | C16.1 C18.1 41.03,66.8 v31.88,66.8 | v52.81,93.98 60.97,93.98 U$2.J1-1 v69.09,88.91 | R19.2 77.75,73.19 v69.09,73.19 | C4(ST7735).+ 13.72,116.85 ST7735.2 | CC1101.2 74.74,127 C19(RF_MODULE).1 69.94,129.41 66.43,129.41 65.2,128.18 U$1.CH_EN 63.21,129.41 60.59,129.41 U$1.VDD 56.93,125.75 C19(WIFI).2 56.53,125.88 C1(WIFI).+ 51.4,126.75 26.13,126.75 R2.1 | TLV5618.8 28.56,147.85 C1(TLV5618).1 18.57,147.85 14.1,143.38 CHANNEL_TURNPOT.2 | v38.99,78.11 v40.93,78.11 v42.67,78.11 v44.45,78.11 v45.91,78.11 46.55,78.11 v47.24,78.8 49.08,80.63 C17.1
  Bottom 0.203: U$9.26 36.99,78.11 v38.99,78.11 | U$9.11 41.42,72.41 42.67,73.66 v42.67,78.11 | U$9.2 45.92,78.1 v45.91,78.11 | U$9.42 43.42,82.18 44.45,81.15 v44.45,78.11 | U$9.37 v40.92,78.11 v40.93,78.11 | U$9.54 47.49,78.55 v47.24,78.8
  Bottom 0.508: R17.2 v9.5,96.53 9.5,112.64 C4(ST7735).+ 14.1,117.23 CHANNEL_TURNPOT.2 | C21.1 C20.1 31.88,79.79 v31.88,66.8 | v69.09,88.91 v69.09,73.19 | R2.1 25.01,124.08 ST7735.2 | R19.2 78.61,72.33 78.61,61.47 76.71,59.56 76.71,39.37 78.8,37.28 R21.1 78.8,29.79 IC1.8 73.2,24.2 C2(MICAMP).2 | C16.1 49.86,60.95 49.86,19.66 v49.78,19.58 | C17.1 C14.1 52.81,84.39 v52.81,93.98 | R3.2 56.65,123.39 C19(WIFI).2 | U$7.3 8.08,36.91 PWR_TEST.2
+5V  (via drill 0.35)
  Top 0.508: U$7.1 3,22.29 14.34,33.63 C3.+ v28.32,33.63 v53.95,33.63 | IC3.6 46.8,144.21 C1.1
  Bottom 0.508: PWR_JMP.2 28.32,4.66 v28.32,33.63 | IC3.6 50.42,142.59 50.42,121.92 63.5,108.84 D1.C 57.78,95.5 57.78,61.98 53.95,58.14 v53.95,33.63 | C3.+ 15.86,37.86 PWR_TEST.3 8.76,44.96 8.76,55.98 KEYBOARD_GROVE.2
AUDIO_AMP_OUT
  Top 0.203: IC3.8 47.84,150.24 36.7,150.24 32,145.54 23.37,145.54 SOUND_TEST.1
  Bottom 0.203: 1+2-AUXSPKR.2 81.15,53.84 81.15,77.85 80.77,78.23 80.77,80.14 84.71,84.07 84.71,130.81 65.28,150.24 49.74,150.24 IC3.8
AUX_AUDIO  (via drill 0.35)
  Top 0.203: 1+2-AUXSPKR.1 82.93,49.52 82.93,45.59 79.88,42.55 79.88,19.18 v77.85,17.14
  Bottom 0.203: U$8.3 U$8.4 78.91,16.09 v77.85,17.14
AUX_MIC
  Top 0.203: U$8.1 74.51,11.77 82.04,19.3 82.04,42.79 84.18,44.92 1+2-ELECTRET.3
CC1101_CLK  (via drill 0.35)
  Top 0.203: v59.82,76.07 59.04,75.3 51.48,75.3 v51.36,75.17 | U$2.J3-23 64.4,83.83 65.81,82.42 v70.99,82.42
  Bottom 0.203: U$9.61 51.24,75.05 v51.36,75.17 | v59.82,76.07 59.82,80.15 U$2.J3-23 | v70.99,82.42 70.99,90.49 CC1101_DEBUG.1 76.03,95.53 76.03,107.5 75.95,107.58 75.95,125.67 CC1101.4
CC1101_CS  (via drill 0.35)
  Top 0.203: v71.88,80.26 65.55,80.26 64.52,81.29 U$2.J3-24 | v51.29,73.55 58.31,73.55 v60.83,76.07 | CC1101_DEBUG.2 75.82,91.95 v81.28,97.41
  Bottom 0.203: v71.88,80.26 71.88,89.03 74.8,91.95 CC1101_DEBUG.2 | U$9.62 50.29,74.55 v51.29,73.55 | v60.83,76.07 60.83,78.63 U$2.J3-24 | v81.28,97.41 81.28,125.92 CC1101.8
CC1101_GDO0  (via drill 0.35)
  Top 0.203: v53.47,79.68 50.42,79.68 v49.91,79.17 | v53.85,61.98 50.55,61.98 47.12,58.55 41.27,58.55 39.12,56.39 35.56,56.39 33.66,58.29 v24,58.29 | v53.72,87.88 71.44,87.88 CC1101_DEBUG.5 78.74,84.33 v82.3,87.88
  Bottom 0.203: U$9.53 49.79,79.05 v49.91,79.17 | U$2.J4-33 24,69.99 v24,58.29 | v53.85,61.98 53.85,79.3 v53.47,79.68 53.47,83.69 53.72,83.95 v53.72,87.88 | CC1101.7 82.3,124.4 v82.3,87.88
CC1101_GDO2  (via drill 0.35)
  Top 0.203: U$2.J4-32 23.64,67.82 v41.91,67.82 62.38,67.82 62.59,67.62 70.28,67.62 v74.93,72.26
  Bottom 0.203: U$9.10 41.92,67.83 v41.91,67.82 | v74.93,72.26 74.93,81.73 CC1101_DEBUG.6 78.23,85.03 78.23,123.64 78.64,124.04 78.64,125.82 CC1101.6
CC1101_MISO  (via drill 0.35)
  Top 0.203: v72.77,77.47 65.67,77.47 64.39,78.75 U$2.J3-25 | v51.07,72.79 58.69,72.79 v61.98,76.07 | CC1101_DEBUG.3 75.06,89.41 v79.25,93.6
  Bottom 0.203: v72.77,77.47 72.77,87.19 CC1101_DEBUG.3 | U$9.63 49.8,74.05 v51.07,72.79 | v61.98,76.07 61.98,77.23 U$2.J3-25 | CC1101.5 80.03,124.17 79.25,123.38 v79.25,93.6
CC1101_MOSI  (via drill 0.35)
  Top 0.203: v73.91,75.18 65.29,75.18 64.26,76.21 U$2.J3-26 63.37,76.21 59.17,72.01 v51.05,72.01
  Bottom 0.203: v73.91,75.18 73.91,85.79 CC1101_DEBUG.4 77.09,88.97 77.09,123.64 77.5,124.04 CC1101.3 | U$9.64 49.51,73.55 v51.05,72.01
CHANNEL_TURNPOT  (via drill 0.35)
  Top 0.203: U$2.J3-29 63.49,68.58 v43.81,68.58 | v43.31,81.53 39.37,81.53 v31.62,89.28 | v31.62,120.27 30.23,121.67 v16.64,121.67
  Bottom 0.203: v43.81,68.58 43.81,71.46 U$9.6 43.92,72.9 43.56,73.26 43.56,81.28 v43.31,81.53 | v31.62,89.28 v31.62,120.27 | v16.64,121.67 CHANNEL_TURNPOT.1
DAC_OUT
  Top 0.203: SOUND_TEST.3 28.45,141.48 29.21,140.72 36.66,140.72 TLV5618.4
  Bottom 0.203: C8.1 38.45,140.84 TLV5618.4
ELECTRET_MIC  (via drill 0.35)
  Top 0.203: 1+2-ELECTRET.1 76.43,46.32 68.97,38.86 v51.18,38.86
  Bottom 0.203: v51.18,38.86 51.18,19.05 46.84,14.71 ELECTRET.+
GND  (via drill 0.35)
  Top 0.508: U$7.2 5.54,21.78 7.88,24.13 C5.- 17.51,22.48 47.49,22.48 C11.- | U$5.GND 36.28,4.79 39.49,8 v41.91,8 49.67,8 RESET.3 RESET.4 U$8.2 | SW2.3 SW2.4 | IC1.4 67.64,33.87 R23.2 | LM4041(MIC).3 54.74,59.14 v54.74,61.59 | C12.2 C13.2 v52.68,95.95 | SW1.3 SW1.4 | C26.2 5.61,83.3 8.67,86.36 17,86.36 19.56,88.91 U$2.J2-20 21.08,88.91 22.37,87.63 27.47,87.63 C21.2 | v30.61,64.26 30.62,64.25 C18.2 C16.2 | v54.71,86.36 54.73,86.37 U$2.J3-22 | ST7735.1 11.18,119.39 C4(ST7735).- 8.56,116.85 JTAG.1 | C19(RF_MODULE).2 74.74,124.46 CC1101.1 | C1(TLV5618).2 28.89,142.77 TLV5618.5 | C1(WIFI).- 56.53,130.96 C19(WIFI).1 57.54,130.84 59.93,133.22 64.48,133.22 U$1.GND | C6(SPKR).- 40.88,146.69 C1.2 48.73,146.69 IC3.7 | C7(SPKR).- 51.35,133.22 v39.5,133.22 R5.2 | v3.81,101.6 C2(ST7735).2 | v38.35,78.99 38.73,79.38 v40.13,79.38 v40.14,79.38 v42.29,79.38 42.3,79.38 v45.41,79.38 v45.42,79.38 48.34,82.3 53.25,82.3 C14.2 | PWR_TEST.1 6.99,41.66 6.99,56.2 KEYBOARD_GROVE.1
  Bottom 0.203: U$9.34 U$9.35 39.92,79.58 v40.13,79.38 40.13,74.17 40.92,73.38 U$9.12 | U$9.3 v45.42,79.38 45.49,79.38 46.81,78.05 U$9.55 | v42.29,79.38 42.29,81.66 41.92,82.03 U$9.39 | U$9.27 37.91,78.55 v38.35,78.99
  Bottom 0.508: C5.- C3.- 11.18,33.24 PWR_TEST.1 | C11.- 47.49,20.3 ELECTRET.- v41.91,8.01 v41.91,8 MICRO_USB.5 | LED2.K 30.93,4.8 U$5.GND | SW2.4 85.09,67.07 85.09,75.63 C27.2 | U$8.2 72.9,9.45 72.9,17.82 C2(MICAMP).1 68.12,23.99 63.79,28.32 R12.1 63.78,30.04 R23.2 59.44,38.22 59.44,50.53 LM4041(MIC).3 64,52.49 SW2.3 | RESET.4 57.52,6.66 C15.2 | v54.74,61.59 54.71,61.62 C22.2 C25.2 C17.2 C14.2 v54.71,86.36 54.71,93.92 v52.68,95.95 | C21.2 C20.2 30.58,77.58 C23.2 C24.2 v30.61,64.26 | CHANNEL_TURNPOT.3 5.37,135.18 LM4041.3 3.81,131.86 3.81,118.4 JTAG.1 3.81,115.31 v3.81,101.6 5.61,99.8 C26.2 6.86,78.88 6.86,67.76 SW1.3 | U$7.4 U$7.2 | ST7735.1 17.78,124.08 21.08,127.38 22.52,127.38 R5.2 28.36,141.99 27.57,142.77 C1(TLV5618).2 | U$1.GND 70.79,130.72 73.62,127.89 73.62,126.01 CC1101.1 | C1(WIFI).- 52.26,134.04 C7(SPKR).- | C6(SPKR).- 39.47,133.25 v39.5,133.22 | IC3.1 53.87,146.75 IC3.7 | SW1.4 10.29,64.53 KEYBOARD_GROVE.1
ICDI-TCK/SWCLK  (via drill 0.35)
  Top 0.203: JTAG.5 6.62,107.95 v51.31,107.95
  Bottom 0.203: U$9.52 49.58,79.55 51.31,81.28 v51.31,107.95
ICDI-TDI  (via drill 0.35)
  Top 0.203: JTAG.3 6.62,113.03 48.97,113.03 v49.02,112.98
  Bottom 0.203: v49.02,112.98 49.02,81.66 49.4,81.28 49.4,80.77 49.18,80.55 U$9.50
ICDI-TDO/SWO  (via drill 0.35)
  Top 0.203: JTAG.2 6.62,115.57 v47.88,115.57
  Bottom 0.203: U$9.49 47.88,81.58 v47.88,115.57
ICDI-TMS/SWDIO  (via drill 0.35)
  Top 0.203: JTAG.4 6.49,110.36 25.4,110.36 26.42,111.38 v50.16,111.38
  Bottom 0.203: U$9.51 49.45,80.05 50.16,80.77 v50.16,111.38
KB_SCL  (via drill 0.35)
  Top 0.203: v45.09,80.92 38.34,80.92 35.69,83.57 27.94,83.57 26.42,85.09 22.11,85.09 20.83,86.37 U$2.J2-19 19.06,86.37 17.78,85.09 v12.7,85.09
  Bottom 0.203: U$9.47 45.92,81.75 v45.09,80.92 | KEYBOARD_GROVE.4 12.7,55.91 v12.7,85.09
KB_SDA  (via drill 0.35)
  Top 0.203: v45.21,80.26 37.59,80.26 35.18,82.68 27.56,82.68 26.42,83.82 25.78,83.82 25.77,83.83 U$2.J4-38 22.01,83.83 20.76,85.09 19.43,85.09 18.41,84.07 v13.72,84.07 | v13.72,55.5 KEYBOARD_GROVE.3
  Bottom 0.203: U$9.48 46.42,81.47 v45.21,80.26 | v13.72,84.07 v13.72,55.5
LED_POWER
  Top 0.203: LED2.A 34.38,11.48 R1.1
MIC_AMPLIFIED  (via drill 0.35)
  Top 0.203: v43.31,69.34 60.31,69.34 62.1,71.13 U$2.J3-28 | IC1.1 69.99,24 MIC_TEST.1 | v65.02,36.32 v57.78,36.32
  Bottom 0.203: U$9.7 43.42,69.46 v43.31,69.34 | U$2.J3-28 62.1,69.74 62.1,63.46 56.11,57.47 R8.2 57.78,42.2 v57.78,36.32 | C9.2 73.13,20.87 IC1.1 65.04,28.96 65.04,36.31 v65.02,36.32
MIC_FEEDBACK/GND
  Top 0.203: R9.2 63.73,24.88 IC1.2
  Bottom 0.203: R8.1 66.29,41.31 66.29,33.78 66.67,33.4 66.67,29.84 67.68,28.84 IC1.2 | R9.2 64.74,22.47 C9.1
MIC_FILTER
  Top 0.203: R13.1 56.96,40.26 67.6,40.26 C10.2
  Bottom 0.203: R10.2 56.17,26.16 R12.2 55.24,30.95 55.24,40.22 R13.1
MIC_FILTERED
  Top 0.203: R10.1 63.8,27.5 IC1.3
MIC_OUT_RAW
  Top 0.203: 1+2-ELECTRET.2 76.68,41.37 C10.1
  Bottom 0.203: 1+2-ELECTRET.2 83.57,44.39 R11.1 84.84,40.1 84.84,28.16 75.6,18.92 MIC_TEST.3
MIC_REF
  Top 0.203: R21.2 75.23,37.55 R22.1
  Bottom 0.203: R22.1 63.75,41.08 R13.2 62.6,42.24 62.6,47.85 61.39,49.06 LM4041(MIC).2 | R21.2 83.57,36.36 R11.2 83.57,29.59 MIC_TEST.2
MIC_REF_FB  (via drill 0.35)
  Top 0.203: R22.2 61.43,37.55 v61.47,37.59
  Bottom 0.203: R23.1 56.13,33.9 R22.2 | LM4041(MIC).1 61.39,37.67 v61.47,37.59
N$1
  Top 0.203: R7.1 35.88,137.72 C8.2
N$2
  Top 0.203: C11.+ 56.09,22.49 R9.1
N$3
  Bottom 0.508: U$2.J3-21 D1.A
OSC0
  Bottom 0.203: U$9.40 42.42,85.03 40.67,86.78 Y1.OSC0 40.67,93.39 C12.1
OSC1
  Bottom 0.203: U$9.41 42.92,85.03 44.67,86.79 Y1.OSC1 C13.1
PB6(UNUSED)  (via drill 0.35)
  Top 0.203: v21.59,60.07 37.47,60.07 39.24,61.85 45.09,61.85 48.64,65.41 v50.8,65.41 v56.64,65.41 | DAC_SPI_DEBUG.2 v56.64,112.78
  Bottom 0.203: U$2.J2-14 21.59,72.4 v21.59,60.07 | U$9.1 46.42,70.55 50.8,66.17 v50.8,65.41 | v56.64,112.78 v56.64,65.41
PC4(DEBUG)  (via drill 0.35)
  Top 0.203: v38.1,70.61 v29.72,70.61 | v29.46,80.9 23.25,80.9 U$2.J4-37 | v21.59,90.81 17.27,95.12 GENERAL_DEBUG.4
  Bottom 0.203: U$9.16 38.1,70.74 v38.1,70.61 | v29.46,80.9 29.72,80.64 v29.72,70.61 | U$2.J4-37 21.59,82.56 v21.59,90.81
PC5(DEBUG)  (via drill 0.35)
  Top 0.203: v38.86,69.72 v28.96,69.72 | v28.96,78.36 23.25,78.36 U$2.J4-36 21.6,80.01 v17.65,80.01 | v17.65,92.46 11.68,92.46 GENERAL_DEBUG.3
  Bottom 0.203: U$9.15 39.42,70.28 v38.86,69.72 | v28.96,69.72 v28.96,78.36 | v17.65,92.46 v17.65,80.01
PC6(DEBUG)  (via drill 0.35)
  Top 0.203: v39.24,68.71 v28.07,68.71 | v28.07,75.56 23.51,75.56 U$2.J4-35 21.86,77.22 v10.54,77.22
  Bottom 0.203: U$9.14 39.92,69.39 v39.24,68.71 | v28.07,68.71 v28.07,75.56 | v10.54,77.22 10.54,89.09 11.49,90.04 GENERAL_DEBUG.2
PC7(DEBUG)  (via drill 0.35)
  Top 0.203: v38.35,65.53 38.23,65.66 v26.54,65.66 | v26.54,73.66 22.87,73.66 U$2.J4-34 21.83,72.64 v11.43,72.64
  Bottom 0.203: U$9.13 40.42,67.6 v38.35,65.53 | v26.54,73.66 v26.54,65.66 | v11.43,72.64 11.43,87.38 GENERAL_DEBUG.1
PF0(UNUSED)  (via drill 0.35)
  Top 0.203: v34.16,80.14 22.49,80.14 21.34,81.29 U$2.J2-17
  Bottom 0.203: U$9.28 36.01,79.05 34.92,80.14 v34.16,80.14
PF1_UNUSED  (via drill 0.35)
  Top 0.203: v39.62,77.07 39.61,77.07 v34.92,72.39 | U$2.J3-30 58.8,66.05 57.28,64.53 49.15,64.53 45.59,60.97 39.75,60.97 37.96,59.18 v34.16,59.18
  Bottom 0.203: v34.92,72.39 34.16,71.63 v34.16,59.18 | U$9.29 38.53,79.55 39.62,78.46 v39.62,77.07
PF2(UNUSED)  (via drill 0.35)
  Top 0.203: v28.19,88.27 23.51,88.27 U$2.J4-40
  Bottom 0.203: U$9.30 35.64,80.05 34.04,81.66 34.04,85.6 31.37,88.27 v28.19,88.27
PF3(UNUSED)  (via drill 0.35)
  Top 0.203: v34.8,81.92 v26.43,81.92 | U$2.J4-39 v26.42,86.37
  Bottom 0.203: U$9.31 36.16,80.55 v34.8,81.92 | v26.42,86.37 26.43,86.36 v26.43,81.92
POWER_INPUT  (via drill 0.35)
  Top 0.508: U$6.1 23.62,2.16 24.89,3.43 29.76,3.43 U$5.VDD 36.16,2.25 40.26,6.35 v44.45,6.35
  Bottom 0.508: MICRO_USB.1 44.51,6.29 v44.45,6.35
POWER_SWITCHED
  Top 0.508: PWR_JMP.1 19.81,4.71 U$6.2
RESET_DEBOUNCE
  Top 0.203: RESET.1 RESET.2
  Bottom 0.203: RESET.1 54.52,8.26 R16.1 54.52,12.29 C15.1 | R14.1 60.73,11.22 RESET.2
RESET_IN  (via drill 0.35)
  Top 0.203: v41.78,73.91 44.45,73.91 v47.37,70.99
  Bottom 0.203: U$9.38 41.42,78.72 41.78,78.36 v41.78,73.91 | R16.2 54.52,23.2 52.45,25.27 52.45,65.91 v47.37,70.99
RSTB_8266  (via drill 0.35)
  Top 0.203: v67.06,72.39 65.55,72.39 64.26,73.67 U$2.J3-27 63.12,73.67 59.56,70.12 v42.92,70.12 | v66.04,104.65 WIFI_DEBUG.3
  Bottom 0.203: U$1.RST_B 61.9,123.14 66.04,119 v66.04,104.65 66.04,90.42 67.06,89.41 v67.06,72.39 | U$9.8 v42.92,70.12
SPKR_OUT  (via drill 0.35)
  Top 0.203: SP1.2 78.06,135.93 v78.11,135.89
  Bottom 0.203: 1+2-AUXSPKR.3 82.89,52.32 81.15,52.32 80.14,53.34 80.14,81.15 83.57,84.58 83.57,130.56 78.23,135.89 v78.11,135.89
SPKRAMP_GND0
  Bottom 0.203: IC3.2 57.78,145.38 57.78,141.22 55.73,139.17 C7(SPKR).+
SPKRAMP_GND1
  Top 0.203: C6(SPKR).+ 52.53,148.1 IC3.3
SPKRAMP_OUT
  Top 0.203: IC3.5 46.95,139.83 20.18,139.83 SP1.1 9.93,138.47 RESISTOR/TURNPOT.3
SPKRAMP_TURNPOT
  Top 0.203: RESISTOR/TURNPOT.1 6.16,137.16 26.17,137.16 R7.2 27.7,138.68 49.4,138.68 52.39,141.67 IC3.4
ST7735_CARD_CS  (via drill 0.35)
  Top 0.203: v46.74,109.22 17.79,109.22 ST7735.5 | U$2.J1-3 64.53,85.34 v45.59,85.34
  Bottom 0.203: v46.74,109.22 46.74,86.49 v45.59,85.34 44.92,84.67 U$9.45
ST7735_DC  (via drill 0.35)
  Top 0.203: v34.95,76.61 29.69,76.61 28.96,77.34 v24.89,77.34 | v39.5,74.8 39.5,74.17 v37.21,71.88 | v67.06,65.02 66.17,64.14 59.56,64.14 58.17,62.74 50.04,62.74 46.61,59.31 40.64,59.31 38.61,57.28 v36.2,57.28
  Bottom 0.203: v34.95,76.61 35,76.55 U$9.23 37.75,76.55 v39.5,74.8 | v24.89,77.34 24.89,104.66 ST7735.4 | v37.21,71.88 36.2,70.87 v36.2,57.28 | v67.06,65.02 67.06,67.58 U$2.J1-9
ST7735_MISO  (via drill 0.35)
  Top 0.203: v34.16,74.8 v16.76,74.8
  Bottom 0.203: U$9.21 34.91,75.55 v34.16,74.8 | U$2.J2-13 16.76,74.69 v16.76,74.8 16.76,98.06 ST7735.9
ST7735_MOSI  (via drill 0.35)
  Top 0.203: v34.04,75.71 29.07,75.71 28.32,76.45 v24,76.45 | v38.61,74.3 38.61,74.17 v36.32,71.88 | v64.77,65.02 59.05,65.02 57.78,63.75 49.66,63.75 46.1,60.2 40.26,60.2 38.35,58.29 v35.18,58.29
  Bottom 0.203: v34.04,75.71 34.38,76.05 U$9.22 37.74,76.05 38.61,75.18 v38.61,74.3 | v24,76.45 24,97.93 ST7735.7 | v36.32,71.88 35.18,70.74 v35.18,58.29 | v64.77,65.02 64.77,69.86 U$2.J1-8
ST7735_RST  (via drill 0.35)
  Top 0.203: v33.27,79.25 v27.3,79.25 | v46.99,76.07 v39.37,76.07 | v52.96,67.07 52.98,67.06 64.02,67.06 65.02,66.05 U$2.J1-10
  Bottom 0.203: v33.27,79.25 35.47,77.05 U$9.24 38.39,77.05 v39.37,76.07 | v27.3,79.25 27.43,79.38 27.43,104.78 17.89,114.31 ST7735.3 | v46.99,76.07 46.99,73.03 52.94,67.07 v52.96,67.07
ST7735_SCK  (via drill 0.35)
  Top 0.203: ST7735.8 17.29,101.61 v14.73,99.06 | v32.89,62.09 24.29,62.09 U$2.J2-11
  Bottom 0.203: U$9.19 36.2,74.55 32.89,71.25 v32.89,62.09 | U$2.J2-11 14.73,71.64 v14.73,99.06
ST7735_TFT_CS  (via drill 0.35)
  Top 0.203: U$2.J2-12 21.63,69.9 21.63,71.41 22.59,72.37 v33,72.37
  Bottom 0.203: U$9.20 35.68,75.05 v33,72.37 | U$2.J2-12 15.75,73.17 15.75,104.66 ST7735.6
SW1  (via drill 0.35)
  Top 0.203: R18.2 14.44,67.44 21.48,67.44 U$2.J4-31 25.92,62.99 v37.21,62.99 | v44.32,74.68 40.93,74.68 v38.12,71.86
  Bottom 0.203: U$9.5 44.42,74.58 v44.32,74.68 | v38.12,71.86 37.21,70.96 v37.21,62.99
SW1_DEBOUNCE
  Top 0.203: SW1.1 SW1.2 | R17.1 4.82,76.8 C26.1
  Bottom 0.203: R17.1 4.42,72.43 R18.1 4.39,69.81 SW1.1
SW2  (via drill 0.35)
  Top 0.203: R20.2 72.92,81.29 U$2.J1-4 65.79,81.29 64.53,82.55 57.66,82.55 55.5,84.71 v46.05,84.71
  Bottom 0.203: U$9.46 45.42,84.08 v46.05,84.71
SW2_DEBOUNCE
  Top 0.203: R20.1 81.86,76.32 C27.1 | SW2.1 SW2.2
  Bottom 0.203: SW2.2 82.96,69.66 R19.1 82.96,76.29 R20.1
TLV5616_REF_FB
  Top 0.203: LM4041.1 8.07,125.65 R4.2 22.62,124.33 27.09,124.33 R5.1
TLV5618_CLK  (via drill 0.35)
  Top 0.203: v76.96,74.3 67.3,74.3 66.67,73.67 U$2.J1-7 65.53,73.67 64.28,74.93 63.12,74.93 59.18,70.99 50.93,70.99 50.04,71.88 v50.04,76.54 | v32.89,117.86 DAC_SPI_DEBUG.4 v80.26,117.86
  Bottom 0.203: U$9.58 50.03,76.55 v50.04,76.54 | v80.26,117.86 80.26,82.93 76.96,79.63 v76.96,74.3 | TLV5618.2 32.89,142.03 v32.89,117.86
TLV5618_CSB  (via drill 0.35)
  Top 0.203: TLV5618.3 41.59,144.21 42.93,142.88 v58.55,142.88 | v51.38,78.67 58.86,78.67 v58.93,78.74 | DAC_SPI_DEBUG.3 v64.77,115.32
  Bottom 0.203: v58.55,142.88 58.55,139.95 58.42,139.83 58.42,124.97 64.77,118.62 v64.77,115.32 64.77,88.66 66.04,87.39 U$2.J1-2 64.52,84.85 62.88,84.85 58.93,80.9 v58.93,78.74 | U$9.57 49.76,77.05 v51.38,78.67
TLV5618_MOSI  (via drill 0.35)
  Top 0.203: v19.43,96.77 v29.08,96.77 | v24.51,71.37 34.92,71.37 38.99,75.44 v44.93,75.44 | DAC_SPI_DEBUG.1 v29.08,110.24
  Bottom 0.203: v19.43,96.77 18.67,96.01 18.67,77.86 U$2.J2-15 21.63,74.91 23.27,74.91 24.51,73.66 v24.51,71.37 | v29.08,96.77 v29.08,110.24 29.08,119.76 31.5,122.17 31.5,143.17 TLV5618.1 | v44.93,75.44 v44.92,75.43 U$9.4
TLV5618_REF
  Top 0.203: R2.2 24.98,133.27 R4.1 7.76,133.27 LM4041.2 | SOUND_TEST.2 24.58,144.21 TLV5618.6
  Bottom 0.203: R4.1 21.84,133.82 SOUND_TEST.2
VDDC  (via drill 0.35)
  Top 0.203: C23.1 38.06,77.56 v38.1,77.6 38.13,77.56 v47.24,77.56 C25.1
  Bottom 0.203: C25.1 C22.1 | U$9.25 38.06,77.55 v38.1,77.6 | C23.1 C24.1 | U$9.56 47.25,77.55 v47.24,77.56
WAKE
  Bottom 0.203: R6.1 36.93,85.75 U$9.32

### Text on the board
tTest: GND | 3.3V | CHANNEL_TURNPOT | RX GPIO_0 GPIO_2 GND / / 3.3 RST 3.3 TX | 3.3 CLK GDO2 CS / / GND MOSI MISO GDO0 | TLV5618_CLK | JTAG3 JTAG2 JTAG1 JTAG0 GND | TLV5618_CSB | PB6 | TLV5618_MOSI | 8266_RX | 8266_RSTB | 8266_GPIO2 | 8266_TX | PC4 | PC5 | PC6 | PC7 | GND | 5V | AUX_AUDIO | AUDIO_AMP_OUT | SPKR_OUT | KB_SDA | KB_SCK | ELECTRET_MIC | MIC_OUT_RAW | AUX_MIC
bTest: CC1101_CLK | CC1101_CS | CC1101_MISO | CC1101_MOSI | CC1101_GDO0 | CC1101_GDO2
tSilk: SPKR_OUT | TLV5618_REF | DAC_OUT | EE 445L Final Project: Walkie Talkie / Yuqi Pan / Kevin Tong / Allen Viljoen / Som Wakdikar | MIC_AMPLIFIED | MIC_REF | MIC_RAW